# Altium project RGB_U585.PrjPcb
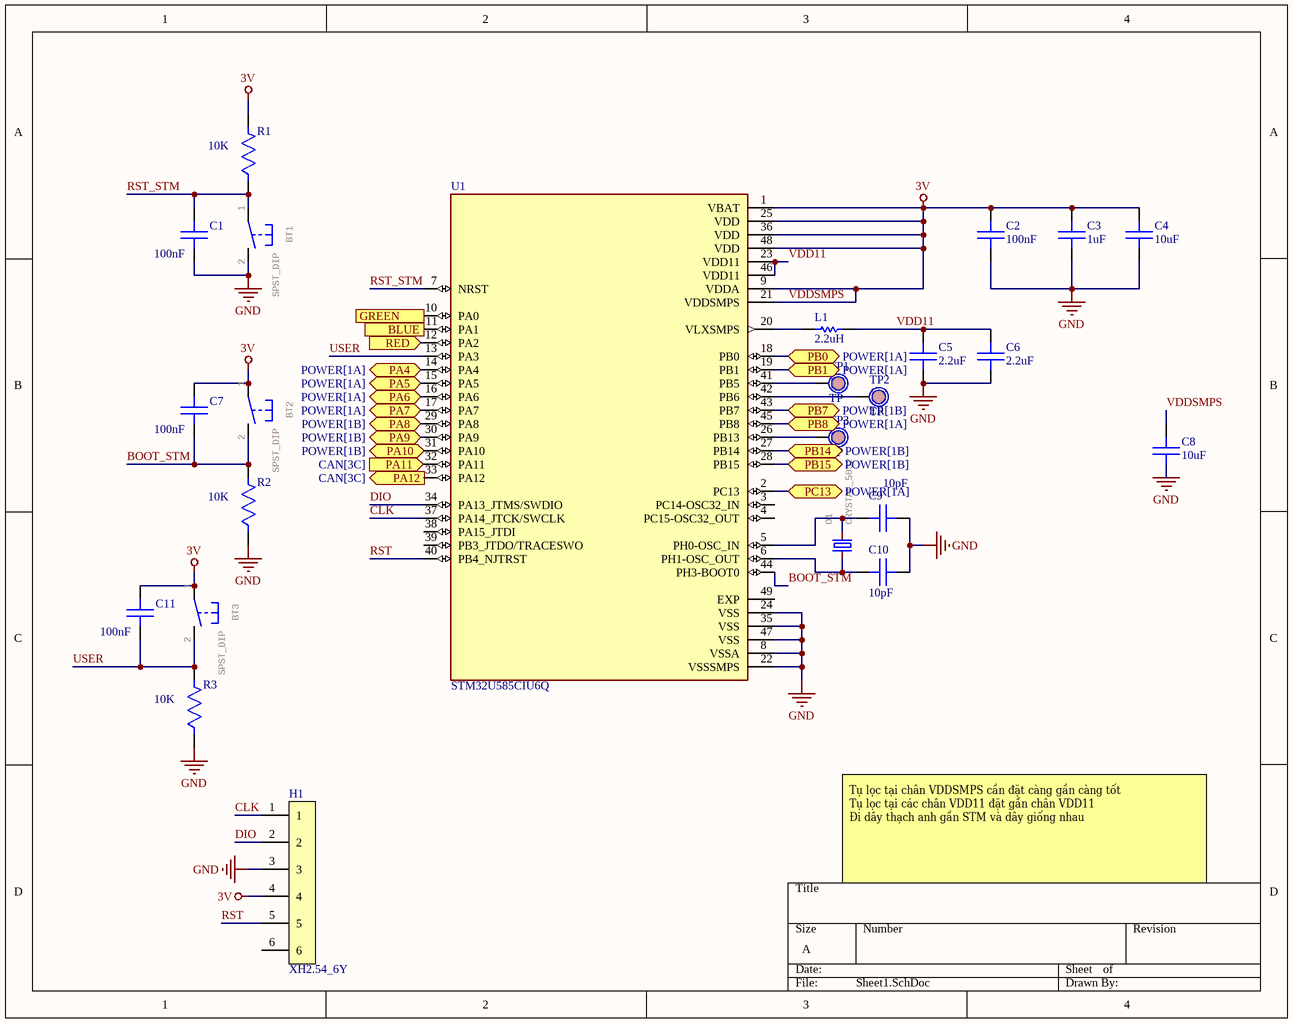
[diagram p0: Sheet1.SchDoc]
4 sheets, 54 parts. Net scope: flat (ports and power ports of the same name join across sheets).
Board file: PCB1.PcbDoc
Sheets:
  Sheet1.SchDoc
  LED RGBSchDoc.SchDoc
  CAN.SchDoc
  POWER.SchDoc

## Sheet Sheet1.SchDoc
size A; SheetNumber: 1; SheetTotal: 4; SPICEModelCacheTQPEDXUI: <root> / <DocumentId>TQPEDXUI</DocumentId> / </root>

### Parts
BT1  SPST_DIP  [SPST_BUTTON_2DIP]
BT2  SPST_DIP  [SPST_BUTTON_2DIP]
BT3  SPST_DIP  [SPST_BUTTON_2DIP]
C1  100nF  [C0603]
C2  100nF  [C0603]
C3  1uF  [C0603]
C4  10uF  [C0603]
C5  2.2uF  [C0603]
C6  2.2uF  [C0603]
C7  100nF  [C0603]
C8  10uF  [C0603]
C9  10pF  [C0603]
C10  10pF  [C0603]
C11  100nF  [C0603]
H1  XH2.54_6Y  [JST-XH-06-PACKAGE-LONG-PAD]
L1  2.2uH  [Res 1206 SMD]
O1  CRYSTAL_5032  [CRYSTAL_5032]
R1  10K  [R0603]
R2  10K  [R0603]
R3  10K  [R0603]
TP1  TP  [Test_point_SMD]
TP2  TP  [Test_point_SMD]
TP3  TP  [Test_point_SMD]
U1  STM32U585CIU6Q  [QFN50P700X700X60-49N]

### Ports
BLUE (in, see LED RGBSchDoc[2B], LED RGBSchDoc[2C], LED RGBSchDoc[3A], LED RGBSchDoc[3B], LED RGBSchDoc[3C]), GREEN (in, see LED RGBSchDoc[1B], LED RGBSchDoc[1C], LED RGBSchDoc[3B], LED RGBSchDoc[3C]), PA4 (bidir, see POWER[1A]), PA5 (bidir, see POWER[1A]), PA6 (bidir, see POWER[1A]), PA7 (bidir, see POWER[1A]), PA8 (bidir, see POWER[1B]), PA9 (bidir, see POWER[1B]), PA10 (bidir, see POWER[1B]), PA11 (in, see CAN[3C]), PA12 (out, see CAN[3C]), PB0 (bidir, see POWER[1A]), PB1 (bidir, see POWER[1A]), PB7 (bidir, see POWER[1B]), PB8 (bidir, see POWER[1A]), PB14 (bidir, see POWER[1B]), PB15 (bidir, see POWER[1B]), PC13 (bidir, see POWER[1A]), RED (in, see LED RGBSchDoc[2B], LED RGBSchDoc[2C], LED RGBSchDoc[3A], LED RGBSchDoc[3B], LED RGBSchDoc[3C])

### Nets
GND: BT1.2 C1.1 C2.1 C3.1 C4.1 C5.1 C6.1 C8.2 C9.2 C10.2 H1.3 R2.1 R3.1 U1.8(VSSA) U1.22(VSSSMPS) U1.24(VSS) U1.35(VSS) U1.47(VSS)
VDDSMPS: BT2.1 BT3.1 C2.2 C3.2 C4.2 C7.2 C8.1 C11.2 H1.4 R1.2 U1.1(VBAT) U1.9(VDDA) U1.21(VDDSMPS) U1.25(VDD) U1.36(VDD) U1.48(VDD)  [also labelled 3V]
BOOT_STM: BT2.2 C7.1 R2.2 U1.44(PH3-BOOT0)
CLK: H1.1 U1.37(PA14_JTCK/SWCLK)
DIO: H1.2 U1.34(PA13_JTMS/SWDIO)
RST: H1.5 U1.40(PB4_NJTRST)
RST_STM: BT1.1 C1.2 R1.1 U1.7(NRST)
USER: BT3.2 C11.1 R3.2 U1.13(PA3)
VDD11: C5.2 C6.2 L1.2 U1.23(VDD11) U1.46(VDD11)
NetC9_1: C9.1 O1.2 U1.5(PH0-OSC_IN)
NetC10_1: C10.1 O1.1 U1.6(PH1-OSC_OUT)
NetHD1_1: U1.19(PB1) ; port PB1
NetHD1_2: U1.18(PB0) ; port PB0
NetHD1_3: U1.17(PA7) ; port PA7
NetHD1_4: U1.16(PA6) ; port PA6
NetHD1_5: U1.15(PA5) ; port PA5
NetHD1_6: U1.14(PA4) ; port PA4
NetHD1_7: U1.2(PC13) ; port PC13
NetHD1_8: U1.45(PB8) ; port PB8
NetHD2_1: U1.27(PB14) ; port PB14
NetHD2_2: U1.28(PB15) ; port PB15
NetHD2_3: U1.29(PA8) ; port PA8
NetHD2_4: U1.30(PA9) ; port PA9
NetHD2_5: U1.43(PB7) ; port PB7
NetHD2_6: U1.31(PA10) ; port PA10
NetJ1_P$1: U1.10(PA0) ; port GREEN
NetJ1_P$2: U1.11(PA1) ; port BLUE
NetJ1_P$3: U1.12(PA2) ; port RED
NetL1_1: L1.1 U1.20(VLXSMPS)
NetTP1_1: TP1.1 U1.41(PB5)
NetTP2_1: TP2.1 U1.42(PB6)
NetTP3_1: TP3.1 U1.26(PB13)
NetU1_32: U1.32(PA11) ; port PA11
NetU1_33: U1.33(PA12) ; port PA12

Not connected (* = marked no-connect by the designer): H1 6; U1 3(PC14-OSC32_IN) 4(PC15-OSC32_OUT) 38(PA15_JTDI) 39(PB3_JTDO/TRACESWO) 49(EXP)

### Notes on the sheet
- Tụ lọc tại chân VDDSMPS cần đặt càng gần càng tốt
  Tụ lọc tại các chân VDD11 đặt gần chân VDD11
  Đi dây thạch anh gần STM và dây giống nhau

### Library data of the parts
BT1-BT3 = SPST_DIP: GateName_1: G$1; SymbolName_1: BT1; DeviceSetName: BT4; LibraryName: Uy_SMD; Package: BT4
C1-C11 = Capacitor 0603
L1 = RES-1206: RES SMD 5.1 OHM 1% 1/4W 1206; Manufacturer: Yageo; Manufacturer Part Number: RC1206FR-075R1L; Resistance (Ohms): 5.1; Power (Watts): 0.25W, 1/4W; Temperature Coefficient: ±200ppm/°C; Supplier 1: Digi-Key; RoHS: RoHS Compliant; Category: Resistors; Stock 1: 96701; Pricing 1: 1=0.1, 10=0.051, 100=0.0207, 1000=0.0093, 2500=0.00807 (USD); Packaging: Cut Tape (CT); Part Status: Active; Tolerance: ±1%; Composition: Thick Film; Features: Moisture Resistant; Operating Temperature: -55°C ~ 155°C; Package / Case: 1206 (3216 Metric); Supplier Device Package: 1206; Size / Dimension: 0.122" L x 0.063" W (3.10mm x 1.60mm); Height - Seated (Max): 0.026" (0.65mm); Failure Rate: -; ComponentLink1URL: http://www.yageo.com/documents/recent/PYu-RC_Group_51_RoHS_L_7.pdf; ComponentLink1Description: http://www.yageo.com/documents/recent/PYu-RC_Group_51_RoHS_L_7.pdf; Supplier Part Number 1: 311-5.10FRCT-ND
O1 = CRYSTAL_5032: GateName_1: G$1; SymbolName_1: Q; DeviceName: -9B; LibraryName: Uy_SMD; DeviceSetName: CRYSTAL_5032; Package: 5.0X3.2_2
R1-R3 = Resistor 0603: SMD Resistor 0603; Manufacturer: Yageo; Manufacturer Part Number: RC0603FR-071KL; Power Rating: 100mW; Tolerance: 1%; Temperature Coefficient: 100ppm/°C; Voltage Rating: 50V; Supplier: Digi-Key; Supplier Part Number: 311-1.00KHRDKR-ND; RoHS: Yes; Category: Chip SMD Resistors; Stock: 18662657; Pricing: 1=0.1, 10=0.018, 50=0.0106, 100=0.0088, 500=0.00592, 1000=0.00505 (USD); Case/Package: 0603; Case Code (Imperial): 0603; Case Code (Metric): 1608; Contact Plating: Tin,Matte; Min Operating Temperature: -55°C; Max Operating Temperature: 155°C; Packaging: Tape and Reel; Resistor Type: Thick Film; Termination: SMD/SMT; Features: Moisture Resistant; Series: RC; Max Power Dissipation: 100mW; Number of Terminations: 2; Resistance Tolerance: 1%; Construction: Rectangular; Technology: THICK FILM; Length: 1.6mm; Height: 0.45mm; Depth: 0.8mm; Reach SVHC Compliant: No; Military Standard: Not; Lead Free: 5697LeadFree; RoHS Compliant: Yes
TP1-TP3 = Test_point_DNM: Test Point; Value: Test Point
U1 = STM32U585CIU6Q: ARM Microcontrollers - MCU Ultra-low-power FPU Arm Cortex-M33 Trust Zone, MCU 160 MHz 2Mbytes of Flash; MF: STMicroelectronics; SnapEDA_Link: https://www.snapeda.com/parts/STM32U585CIU6Q/STMicroelectronics/view-part/?ref=snap; Package: UFQFPN-48 STMicroelectronics; Value: *; MP: STM32U585CIU6Q; Check_prices: https://www.snapeda.com/parts/STM32U585CIU6Q/STMicroelectronics/view-part/?ref=eda

## Sheet LED RGBSchDoc.SchDoc
size A3; SheetNumber: 2; SheetTotal: 4
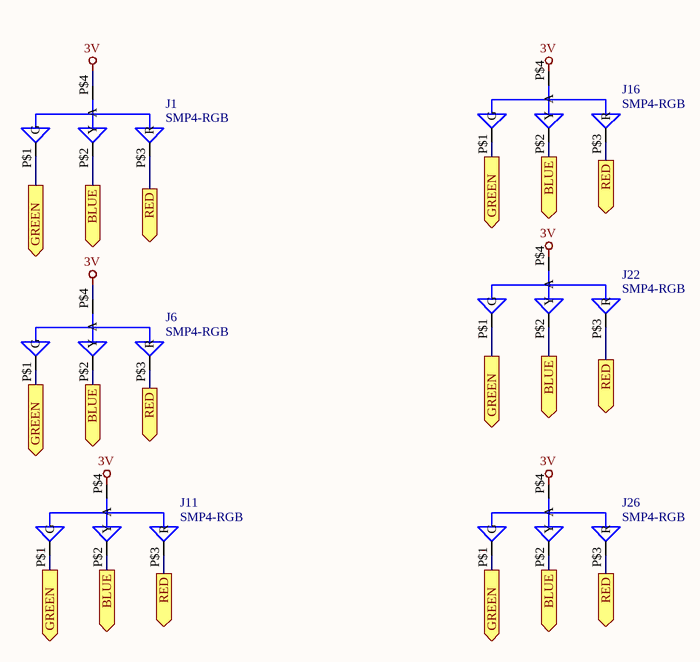
[diagram p1: LED RGBSchDoc.SchDoc]

### Parts
J1  SMP4-RGB  [4-PLCC]
J6  SMP4-RGB  [4-PLCC]
J11  SMP4-RGB  [4-PLCC]
J16  SMP4-RGB  [4-PLCC]
J22  SMP4-RGB  [4-PLCC]
J26  SMP4-RGB  [4-PLCC]

### Ports
BLUE (out, see LED RGBSchDoc[2B], LED RGBSchDoc[2C], LED RGBSchDoc[3A], LED RGBSchDoc[3B], LED RGBSchDoc[3C], Sheet1[2B]), BLUE (out, see LED RGBSchDoc[2B], LED RGBSchDoc[2C], LED RGBSchDoc[3A], LED RGBSchDoc[3B], Sheet1[2B]), BLUE (out, see LED RGBSchDoc[2B], LED RGBSchDoc[2C], LED RGBSchDoc[3A], LED RGBSchDoc[3C], Sheet1[2B]), BLUE (out, see LED RGBSchDoc[2B], LED RGBSchDoc[2C], LED RGBSchDoc[3B], LED RGBSchDoc[3C], Sheet1[2B]), BLUE (out, see LED RGBSchDoc[2B], LED RGBSchDoc[3A], LED RGBSchDoc[3B], LED RGBSchDoc[3C], Sheet1[2B]), GREEN (out, see LED RGBSchDoc[1B], LED RGBSchDoc[1C], LED RGBSchDoc[3B], LED RGBSchDoc[3C], Sheet1[2B]), GREEN (out, see LED RGBSchDoc[1B], LED RGBSchDoc[1C], LED RGBSchDoc[3B], Sheet1[2B]), GREEN (out, see LED RGBSchDoc[1B], LED RGBSchDoc[3B], LED RGBSchDoc[3C], Sheet1[2B]), RED (out, see LED RGBSchDoc[2B], LED RGBSchDoc[2C], LED RGBSchDoc[3A], LED RGBSchDoc[3B], LED RGBSchDoc[3C], Sheet1[2B]), RED (out, see LED RGBSchDoc[2B], LED RGBSchDoc[2C], LED RGBSchDoc[3A], LED RGBSchDoc[3B], Sheet1[2B]), RED (out, see LED RGBSchDoc[2B], LED RGBSchDoc[2C], LED RGBSchDoc[3A], LED RGBSchDoc[3C], Sheet1[2B]), RED (out, see LED RGBSchDoc[2B], LED RGBSchDoc[2C], LED RGBSchDoc[3B], LED RGBSchDoc[3C], Sheet1[2B]), RED (out, see LED RGBSchDoc[2B], LED RGBSchDoc[3A], LED RGBSchDoc[3B], LED RGBSchDoc[3C], Sheet1[2B])

### Nets
3V: J1.P$4(A) J6.P$4(A) J11.P$4(A) J16.P$4(A) J22.P$4(A) J26.P$4(A)  [project net VDDSMPS]
NetJ1_P$1: J1.P$1(G) J6.P$1(G) J11.P$1(G) J16.P$1(G) J22.P$1(G) J26.P$1(G) ; port GREEN
NetJ1_P$2: J1.P$2(Y) J6.P$2(Y) J11.P$2(Y) J16.P$2(Y) J22.P$2(Y) J26.P$2(Y) ; port BLUE
NetJ1_P$3: J1.P$3(R) J6.P$3(R) J11.P$3(R) J16.P$3(R) J22.P$3(R) J26.P$3(R) ; port RED

### Library data of the parts
J1 J6 J11 J16 J22 J26 = SMP4-RGB: Red, Green, Blue (RGB) 640nm Red, 570nm Green, 466nm Blue LED Indication - Discrete 1.85V Red, 1.9V Green, 3.3V Blue 4-PLCC; MF: Bivar Inc.; SnapEDA_Link: https://www.snapeda.com/parts/SMP4-RGB/Bivar+Inc./view-part/?ref=snap; Package: PLCC-4 Bivar; Value: *; MP: SMP4-RGB; Check_prices: https://www.snapeda.com/parts/SMP4-RGB/Bivar+Inc./view-part/?ref=eda

## Sheet CAN.SchDoc
size A; SheetNumber: 3; SheetTotal: 4
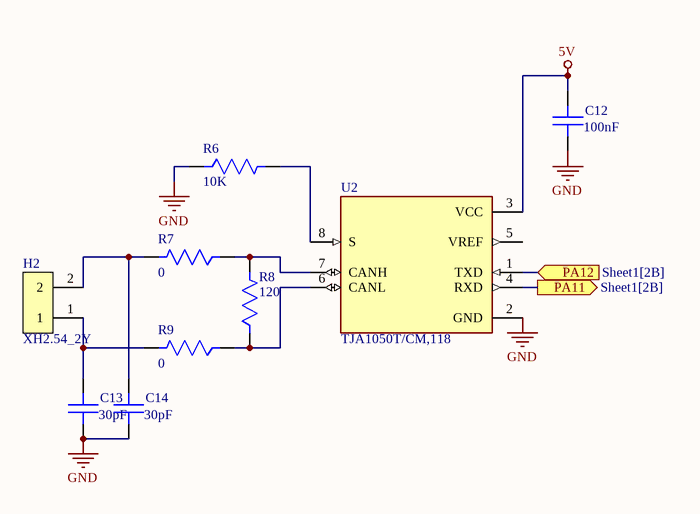
[diagram p2: CAN.SchDoc]

### Parts
C12  100nF  [C0603]
C13  30pF  [C0603]
C14  30pF  [C0603]
H2  XH2.54_2Y  [JST-XH-02-PACKAGE-LONG-PAD]
R6  10K  [R0603]
R7  0  [R0603]
R8  120  [R0603]
R9  0  [R0603]
U2  TJA1050T/CM,118  [SOIC127P600X175-8N]

### Ports
PA11 (out, see Sheet1[2B]), PA12 (in, see Sheet1[2B])

### Nets
5V: C12.1 U2.3(VCC)
GND: C12.2 C13.2 C14.2 R6.1 U2.2(GND)
NetC13_1: C13.1 H2.1 R9.2
NetC14_1: C14.1 H2.2 R7.2
NetR6_2: R6.2 U2.8(S)
NetR7_1: R7.1 R8.2 U2.7(CANH)
NetR8_1: R8.1 R9.1 U2.6(CANL)
NetU1_32: U2.4(RXD) ; port PA11
NetU1_33: U2.1(TXD) ; port PA12

Not connected (* = marked no-connect by the designer): U2 5(VREF)

### Library data of the parts
C12-C14 = Capacitor 0603
R6-R9 = Resistor 0603: as R1 on sheet Sheet1; Supplier: Digi-Key; Supplier Part Number: 311-1.00KHRDKR-ND; RoHS: Yes; Category: Chip SMD Resistors; Stock: 18662657; Pricing: 1=0.1, 10=0.018, 50=0.0106, 100=0.0088, 500=0.00592, 1000=0.00505 (USD); Case/Package: 0603; Case Code (Imperial): 0603; Case Code (Metric): 1608; Contact Plating: Tin,Matte; Min Operating Temperature: -55°C; Max Operating Temperature: 155°C; Packaging: Tape and Reel; Resistor Type: Thick Film; Termination: SMD/SMT; Features: Moisture Resistant; Series: RC; Max Power Dissipation: 100mW; Number of Terminations: 2; Resistance Tolerance: 1%; Construction: Rectangular; Technology: THICK FILM; Length: 1.6mm; Height: 0.45mm; Depth: 0.8mm; Reach SVHC Compliant: No; Military Standard: Not; Lead Free: 5697LeadFree; RoHS Compliant: Yes
U2 = TJA1050T/CM,118: 1/1 Transceiver Half CANbus 8-SO; MF: NXP USA; SnapEDA_Link: https://www.snapeda.com/parts/TJA1050T/CM,118/NXP%20USA%20Inc./view-part/304529/?ref=snap; Value: *; Purchase-URL: https://pricing.snapeda.com/search/part/TJA1050T/CM,118/?ref=eda; Check_prices: https://www.snapeda.com/parts/TJA1050T/CM,118/NXP%20USA%20Inc./view-part/304529/?ref=eda; Price: None; Availability: In Stock; MP: TJA1050T/CM,118; Package: SO-8 NXP Semiconductors

## Sheet POWER.SchDoc
size A; SheetNumber: 4; SheetTotal: 4; SPICEModelCacheYKRLJLQR: <root> / <DocumentId>YKRLJLQR</DocumentId> / </root>
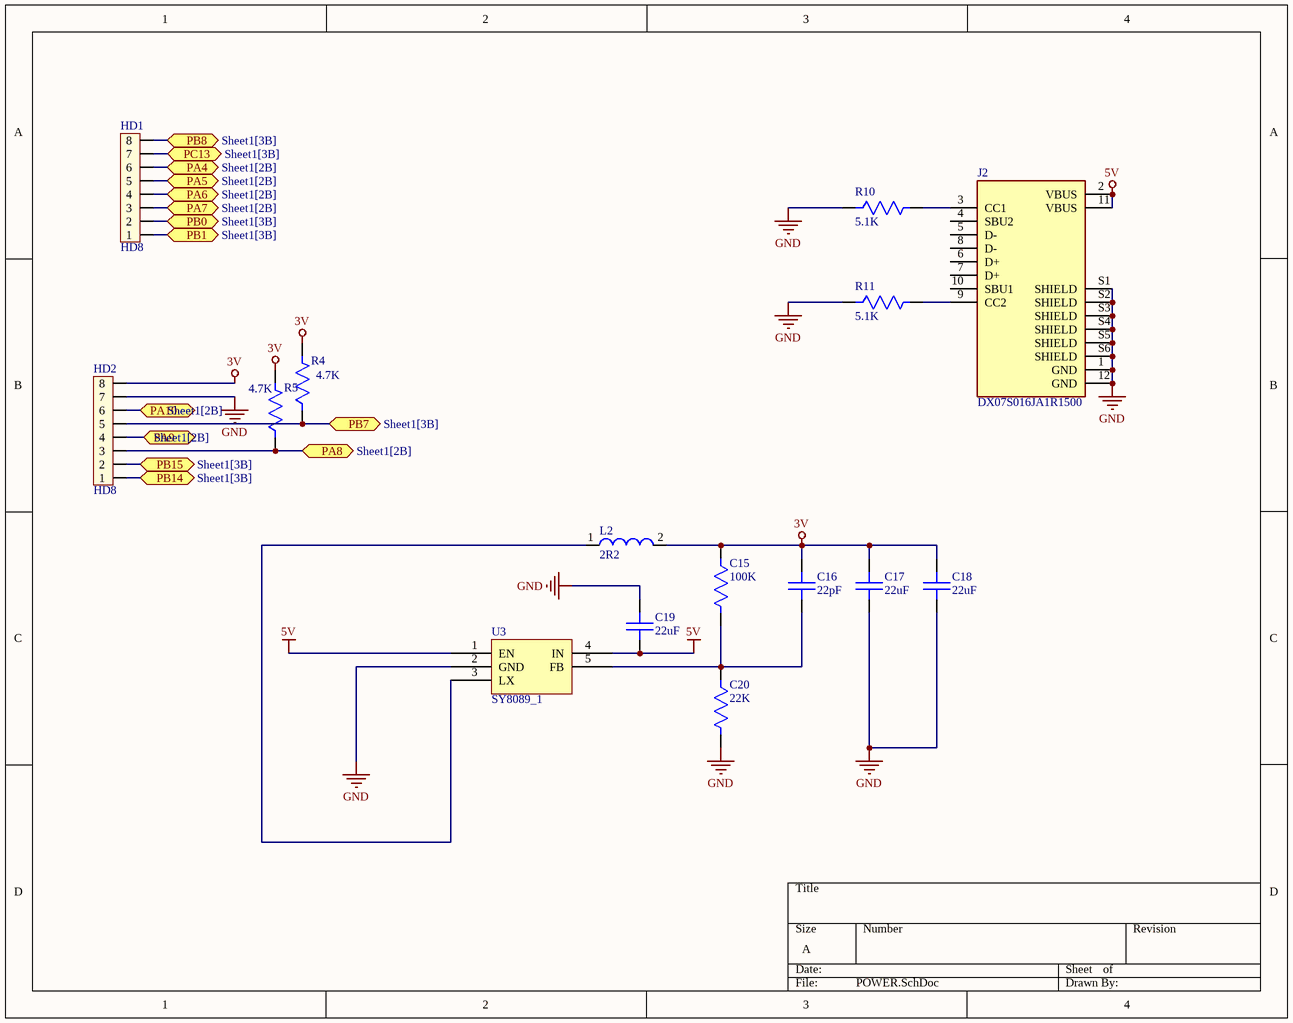
[diagram p3: POWER.SchDoc]

### Parts
C15  100K  [R0603]
C16  22pF  [C0603]
C17  22uF  [C0603]
C18  22uF  [C0603]
C19  22uF  [C0603]
C20  22K  [R0603]
HD1  HD8  [Header_8]
HD2  HD8  [Header_8]
J2  DX07S016JA1R1500  [JAE_DX07S016JA1R1500]
L2  2R2  [L0630]
R4  4.7K  [R0603]
R5  4.7K  [R0603]
R10  5.1K  [R0603]
R11  5.1K  [R0603]
U3  SY8089_1  [SOT23-5]

### Ports
PA4 (bidir, see Sheet1[2B]), PA5 (bidir, see Sheet1[2B]), PA6 (bidir, see Sheet1[2B]), PA7 (bidir, see Sheet1[2B]), PA8 (bidir, see Sheet1[2B]), PA9 (bidir, see Sheet1[2B]), PA10 (bidir, see Sheet1[2B]), PB0 (bidir, see Sheet1[3B]), PB1 (bidir, see Sheet1[3B]), PB7 (bidir, see Sheet1[3B]), PB8 (bidir, see Sheet1[3B]), PB14 (bidir, see Sheet1[3B]), PB15 (bidir, see Sheet1[3B]), PC13 (bidir, see Sheet1[3B])

### Nets
3V: C15.1 C16.2 C17.2 C18.2 HD2.8 L2.2 R4.2 R5.2  [project net VDDSMPS]
5V: C19.2 J2.2(VBUS) J2.11(VBUS) U3.1(EN) U3.4(IN)
GND: C17.1 C18.1 C19.1 C20.2 HD2.7 J2.1(GND) J2.12(GND) J2.S1(SHIELD) J2.S2(SHIELD) J2.S3(SHIELD) J2.S4(SHIELD) J2.S5(SHIELD) J2.S6(SHIELD) R10.1 R11.1 U3.2(GND)
NetC15_2: C15.2 C16.1 C20.1 U3.5(FB)
NetHD1_1: HD1.1 ; port PB1
NetHD1_2: HD1.2 ; port PB0
NetHD1_3: HD1.3 ; port PA7
NetHD1_4: HD1.4 ; port PA6
NetHD1_5: HD1.5 ; port PA5
NetHD1_6: HD1.6 ; port PA4
NetHD1_7: HD1.7 ; port PC13
NetHD1_8: HD1.8 ; port PB8
NetHD2_1: HD2.1 ; port PB14
NetHD2_2: HD2.2 ; port PB15
NetHD2_3: HD2.3 R5.1 ; port PA8
NetHD2_4: HD2.4 ; port PA9
NetHD2_5: HD2.5 R4.1 ; port PB7
NetHD2_6: HD2.6 ; port PA10
NetJ2_3: J2.3(CC1) R10.2
NetJ2_9: J2.9(CC2) R11.2
NetL2_1: L2.1 U3.3(LX)

Not connected (* = marked no-connect by the designer): J2 4(SBU2) 5(D-) 6(D+) 7(D+) 8(D-) 10(SBU1)

### Library data of the parts
C15 C20 R4 R5 R10 R11 = Resistor 0603: as R1 on sheet Sheet1; Supplier: Digi-Key; Supplier Part Number: 311-1.00KHRDKR-ND; RoHS: Yes; Category: Chip SMD Resistors; Stock: 18662657; Pricing: 1=0.1, 10=0.018, 50=0.0106, 100=0.0088, 500=0.00592, 1000=0.00505 (USD); Case/Package: 0603; Case Code (Imperial): 0603; Case Code (Metric): 1608; Contact Plating: Tin,Matte; Min Operating Temperature: -55°C; Max Operating Temperature: 155°C; Packaging: Tape and Reel; Resistor Type: Thick Film; Termination: SMD/SMT; Features: Moisture Resistant; Series: RC; Max Power Dissipation: 100mW; Number of Terminations: 2; Resistance Tolerance: 1%; Construction: Rectangular; Technology: THICK FILM; Length: 1.6mm; Height: 0.45mm; Depth: 0.8mm; Reach SVHC Compliant: No; Military Standard: Not; Lead Free: 5697LeadFree; RoHS Compliant: Yes
C16-C19 = Capacitor 0603
HD1 HD2 = Header8: Header 8; Creat by: VanDungEvn@Gmail.com
J2 = DX07S016JA1R1500: USB-C (USB TYPE-C) USB 2.0 Receptacle Connector 24 (16+8 Dummy) Position Surface Mount, Right Angle; Through Hole; Package: None; Value: *; Price: None; MP: DX07S016JA1R1500; Availability: Unavailable
L2 = Inductor 0630: HIGH POWER INDUCTOR 1040; MF: Wurth Electronics; MP: 74437368047; Value: *; Price: None; Package: Nonstandard Wurth Electronics; SnapEDA_Link: https://www.snapeda.com/parts/74437368047/Wurth%20Electronics%20Inc./view-part/286863/?ref=snap; Availability: Unavailable

## Nets that join several sheets
5V: CAN (C12.1 U2.3), POWER (5 pins)
GND: Sheet1 (18 pins), CAN (5 pins), POWER (16 pins)
VDDSMPS: Sheet1 (16 pins), LED RGBSchDoc (6 pins), POWER (8 pins)
NetHD1_1: Sheet1 (U1.19), POWER (HD1.1)
NetHD1_2: Sheet1 (U1.18), POWER (HD1.2)
NetHD1_3: Sheet1 (U1.17), POWER (HD1.3)
NetHD1_4: Sheet1 (U1.16), POWER (HD1.4)
NetHD1_5: Sheet1 (U1.15), POWER (HD1.5)
NetHD1_6: Sheet1 (U1.14), POWER (HD1.6)
NetHD1_7: Sheet1 (U1.2), POWER (HD1.7)
NetHD1_8: Sheet1 (U1.45), POWER (HD1.8)
NetHD2_1: Sheet1 (U1.27), POWER (HD2.1)
NetHD2_2: Sheet1 (U1.28), POWER (HD2.2)
NetHD2_3: Sheet1 (U1.29), POWER (HD2.3 R5.1)
NetHD2_4: Sheet1 (U1.30), POWER (HD2.4)
NetHD2_5: Sheet1 (U1.43), POWER (HD2.5 R4.1)
NetHD2_6: Sheet1 (U1.31), POWER (HD2.6)
NetJ1_P$1: Sheet1 (U1.10), LED RGBSchDoc (6 pins)
NetJ1_P$2: Sheet1 (U1.11), LED RGBSchDoc (6 pins)
NetJ1_P$3: Sheet1 (U1.12), LED RGBSchDoc (6 pins)
NetU1_32: Sheet1 (U1.32), CAN (U2.4)
NetU1_33: Sheet1 (U1.33), CAN (U2.1)